# Altium schematic sheet mcu.SchDoc
size A4
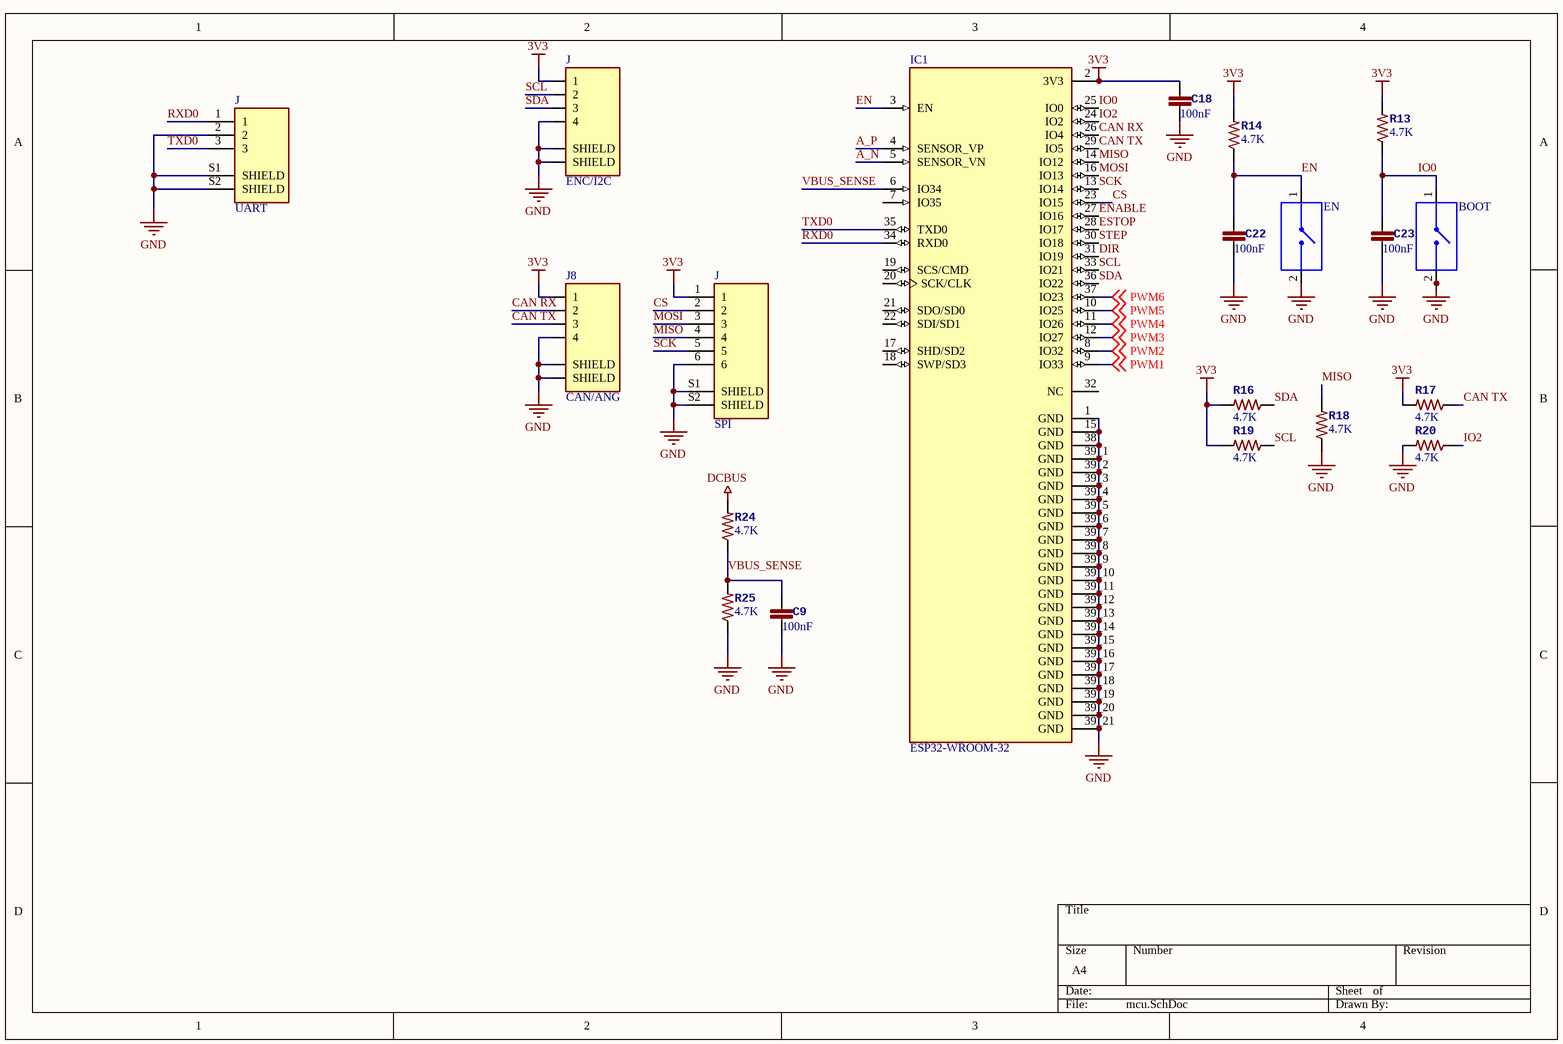
[diagram p0: mcu.SchDoc]

## Parts
(Parts that share a designator on the sheet are numbered #1, #2 ... from top to bottom, then left to right.)
BOOT  1437566-4  [SW_1437566-4]  (value not drawn)
C9  value 100nF  [_0805]  (hidden comment: Cap)
C18  value 100nF  [_0805]  (hidden comment: Cap)
C22  value 100nF  [_0805]  (hidden comment: Cap)
C23  value 100nF  [_0805]  (hidden comment: Cap)
EN  1437566-4  [SW_1437566-4]  (value not drawn)
IC1  ESP32-WROOM-32  [MODULE_ESP32-WROOM-32]
J8  CAN/ANG  [JST_SM04B-SRSS-TB(LF)(SN)]
J#1  ENC/I2C  [JST_SM04B-SRSS-TB(LF)(SN)]
J#2  UART  [JST_SM03B-SRSS-TB(LF)(SN)]
J#3  SPI  [JST_SM06B-SRSS-TB(LF)(SN)]
R13  value 4.7K  [_0805]  (hidden comment: Resistor)
R14  value 4.7K  [_0805]  (hidden comment: Resistor)
R16  value 4.7K  [_0805]  (hidden comment: Resistor)
R17  value 4.7K  [_0805]  (hidden comment: Resistor)
R18  value 4.7K  [_0805]  (hidden comment: Resistor)
R19  value 4.7K  [_0805]  (hidden comment: Resistor)
R20  value 4.7K  [_0805]  (hidden comment: Resistor)
R24  value 4.7K  [_0805]  (hidden comment: Resistor)
R25  value 4.7K  [_0805]  (hidden comment: Resistor)

## Nets
3V3: C18.1 IC1.2(3V3) J8.1 J#1.1 J#3.1 R13.2 R14.2 R16.2 R17.2 R19.2
DCBUS: R24.2
GND: BOOT.2 C9.2 C18.2 C22.2 C23.2 EN.2 IC1.1(GND) IC1.15(GND) IC1.38(GND) IC1.39_1(GND) IC1.39_2(GND) IC1.39_3(GND) IC1.39_4(GND) IC1.39_5(GND) IC1.39_6(GND) IC1.39_7(GND) IC1.39_8(GND) IC1.39_9(GND) IC1.39_10(GND) IC1.39_11(GND) IC1.39_12(GND) IC1.39_13(GND) IC1.39_14(GND) IC1.39_15(GND) IC1.39_16(GND) IC1.39_17(GND) IC1.39_18(GND) IC1.39_19(GND) IC1.39_20(GND) IC1.39_21(GND) J8.4 J8.S1(SHIELD) J8.S2(SHIELD) J#1.4 J#1.S1(SHIELD) J#1.S2(SHIELD) J#2.2 J#2.S1(SHIELD) J#2.S2(SHIELD) J#3.6 J#3.S1(SHIELD) J#3.S2(SHIELD) R18.1 R20.2 R25.1
A_N: IC1.5(SENSOR_VN)
A_P: IC1.4(SENSOR_VP)
CAN RX: IC1.26(IO4) J8.2
CAN TX: IC1.29(IO5) J8.3 R17.1
CS: IC1.23(IO15) J#3.2
DIR: IC1.31(IO19)
EN: C22.1 EN.1 IC1.3(EN) R14.1
ENABLE: IC1.27(IO16)
ESTOP: IC1.28(IO17)
IO0: BOOT.1 C23.1 IC1.25(IO0) R13.1
IO2: IC1.24(IO2) R20.1
MISO: IC1.14(IO12) J#3.4 R18.2
MOSI: IC1.16(IO13) J#3.3
PWM1: IC1.9(IO33) ; off-sheet PWM1
PWM2: IC1.8(IO32) ; off-sheet PWM2
PWM3: IC1.12(IO27) ; off-sheet PWM3
PWM4: IC1.11(IO26) ; off-sheet PWM4
PWM5: IC1.10(IO25) ; off-sheet PWM5
PWM6: IC1.37(IO23) ; off-sheet PWM6
RXD0: IC1.34(RXD0) J#2.1
SCK: IC1.13(IO14) J#3.5
SCL: IC1.33(IO21) J#1.2 R19.1
SDA: IC1.36(IO22) J#1.3 R16.1
STEP: IC1.30(IO18)
TXD0: IC1.35(TXD0) J#2.3
VBUS_SENSE: C9.1 IC1.6(IO34) R24.1 R25.2

Not connected (* = marked no-connect by the designer): IC1 7(IO35) 17(SHD/SD2) 18(SWP/SD3) 19(SCS/CMD) 20(SCK/CLK) 21(SDO/SD0) 22(SDI/SD1) 32(NC)

## Library data of the parts
BOOT EN = 1437566-4: Switch Tactile OFF _ON_ SPST Rectangular Button Gull Wing 0.05A 12VDC 1.77N SMD T/R; MF: TE Connectivity; Configuration_Pole-Throw: Single Pole - Single Throw; Contact_Current_Rating: 50 mA; MP: FSMSMTR; Package: None; Digi-Key_Part_Number: 450-1758-1-ND; Digi-Key_Purchase_URL: https://www.digikey.com/product-detail/en/te-connectivity-alcoswitch-switches/FSMSMTR/450-1758-1-ND/2271637?utm_source=snapeda&utm_medium=aggregator&utm_campaign=symbol; Value: *; TE_purchase_URL: https://www.te.com/usa-en/product-1437566-4.html?te_bu=Cor&te_type=disp&te_campaign=seda_glo_cor-seda-global-disp-prtnr-fy19-seda-model-bom-cta_sma-317_1&elqCampaignId=32493; SnapEDA_Link: https://www.snapeda.com/parts/FSMSMTR/TE%20Connectivity%20ALCOSWITCH%20Switches/view-part/2118497/?ref=snap
C9 C18 C22 C23 = Cap_1
IC1 = ESP32-WROOM-32: Bluetooth, WiFi 802.11b/g/n, Bluetooth v4.2 +EDR, Class 1, 2 and 3 Transceiver Module 2.4GHz ~ 2.5GHz Antenna Not Included, U.FL Surface Mount; MF: Espressif Systems; MP: ESP32-WROOM-32; Purchase-URL: https://pricing.snapeda.com/search/part/ESP32-WROOM-32/?ref=eda; Package: Module Espressif Systems; Value: *; Digi-Key_Part_Number: 1965-ESP32-WROOM-32U-N4CT-ND; Check_prices: https://www.snapeda.com/parts/ESP32-WROOM-32/Espressif+Systems/view-part/?ref=eda; SnapEDA_Link: https://www.snapeda.com/parts/ESP32-WROOM-32/Espressif+Systems/view-part/?ref=snap
J8 J#1 = SM04B-SRSS-TB(LF)(SN): Connector Header Surface Mount, Right Angle 4 position 0.039 _1.00mm_; MF: JST Sales; MP: SM04B-SRSS-TB_LF__SN_; Price: None; SnapEDA_Link: https://www.snapeda.com/parts/SM04B-SRSS-TB%28LF%29%28SN%29/JST%20Sales%20America%20Inc./view-part/557466/?ref=snap; Value: *; Availability: Unavailable; Package: None
J#2 = SM03B-SRSS-TB(LF)(SN): Connector Header Surface Mount, Right Angle 3 position 0.039 _1.00mm_; MP: SM03B-SRSS-TB_LF__SN_; MF: JST Sales; SnapEDA_Link: https://www.snapeda.com/parts/SM03B-SRSS-TB%28LF%29%28SN%29/JST%20Sales%20America%20Inc./view-part/3227115/?ref=snap; Availability: Unavailable; Price: None; Value: *; Package: None
J#3 = SM06B-SRSS-TB(LF)(SN): Connector Header Surface Mount, Right Angle 6 position 0.039 _1.00mm_; MP: SM06B-SRSS-TB_LF__SN_; MF: JST Sales; Package: None; Value: *; SnapEDA_Link: https://www.snapeda.com/parts/SM06B-SRSS-TB%28LF%29%28SN%29/JST%20Sales%20America%20Inc./view-part/554386/?ref=snap; Digi-Key_Purchase_URL: https://www.digikey.com/product-detail/en/jst-sales-america-inc/SM06B-SRSS-TB_LF__SN_/455-1806-1-ND/926877?utm_source=snapeda&utm_medium=aggregator&utm_campaign=symbol; Digi-Key_Part_Number: 455-1806-1-ND